# Altium schematic sheet tinyCore.SchDoc
size 444 x 241 mm; SheetNumber: 1; SheetTotal: 4
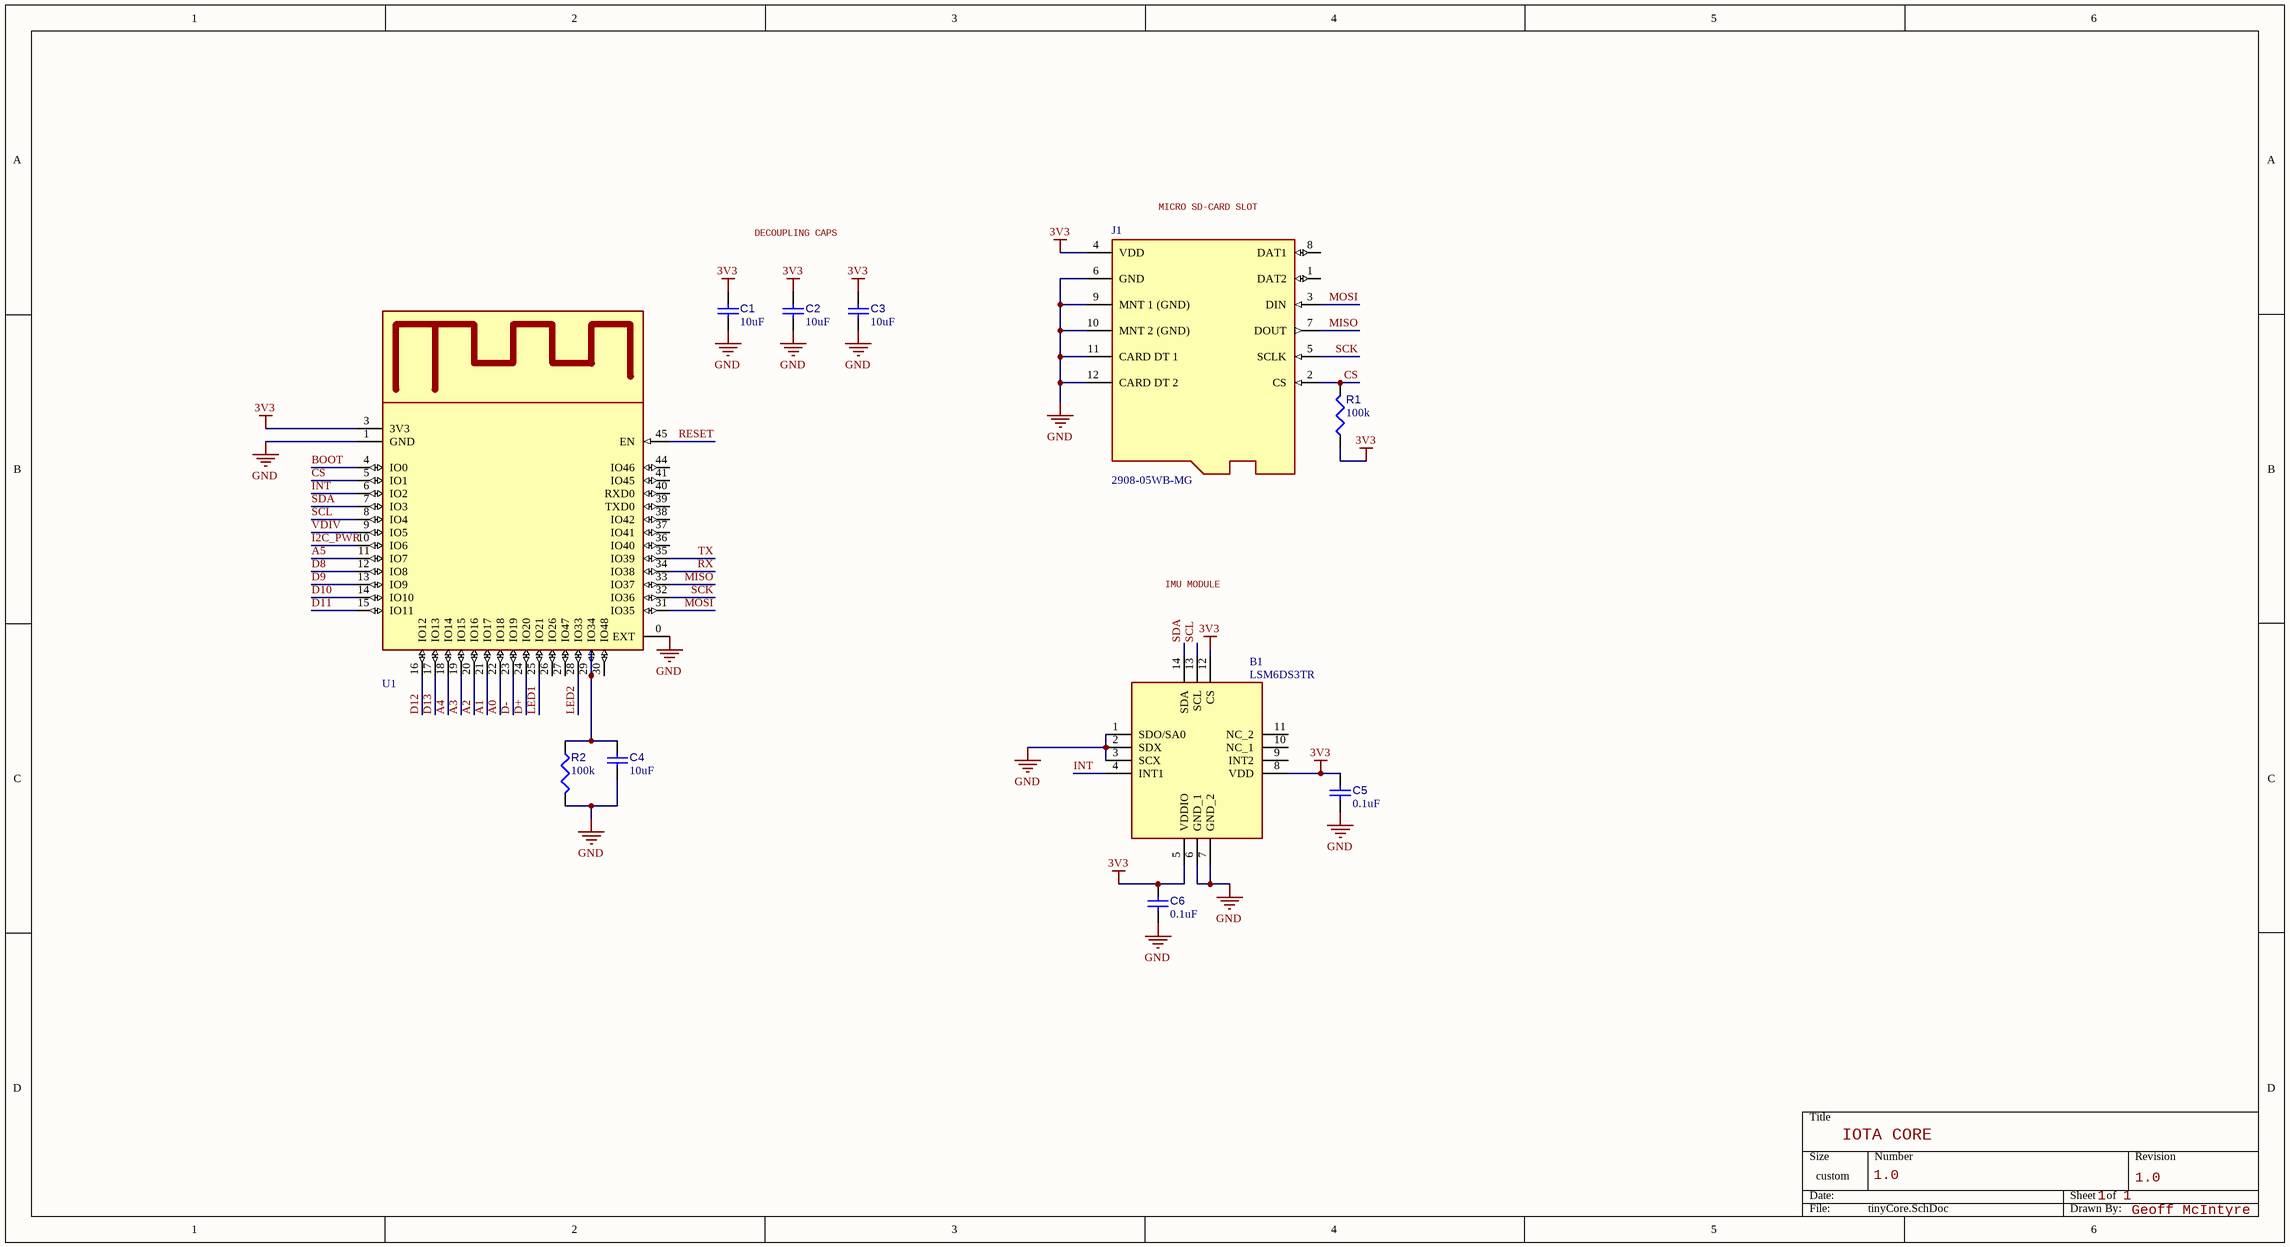
[diagram p0: tinyCore.SchDoc]

## Parts
B1  LSM6DS3TR  [LSM6DS3TR]
C1  value 10uF  [CAPC1608X87X35NL15T15]  (hidden comment: Capacitor 10 uF +/- 0.25 uF 50 V 0603)
C2  value 10uF  [CAPC1608X87X35NL15T15]  (hidden comment: Capacitor 10 uF +/- 0.25 uF 50 V 0603)
C3  value 10uF  [CAPC1608X87X35NL15T15]  (hidden comment: Capacitor 10 uF +/- 0.25 uF 50 V 0603)
C4  value 10uF  [CAPC1608X87X35NL15T15]  (hidden comment: Capacitor 10 uF +/- 0.25 uF 50 V 0603)
C5  value 0.1uF  [CAPC1608X87X35NL15T15]  (hidden comment: Capacitor  0.1 uF 50 V 0603)
C6  value 0.1uF  [CAPC1608X87X35NL15T15]  (hidden comment: Capacitor  0.1 uF 50 V 0603)
J1  2908-05WB-MG  [FP-2908-05WB-MG-MFG]
R1  value 100k  [RESC1608X55X25ML10T15]  (hidden comment: Resistor 100k +/-1% 0603 100 mW)
R2  value 100k  [RESC1608X55X25ML10T15]  (hidden comment: Resistor 100k +/-1% 0603 100 mW)
U1  ESP32-S3-MINI-1-N8  [ESP32-S3-MINI-1-N8]  (value not drawn)

## Nets
3V3: B1.5(VDDIO) B1.8(VDD) B1.12(CS) C1.2 C2.2 C3.2 C5.2 C6.2 J1.4(VDD) R1.1 U1.3(3V3)
GND: B1.1(SDO/SA0) B1.2(SDX) B1.3(SCX) B1.6(GND_1) B1.7(GND_2) C1.1 C2.1 C3.1 C4.1 C5.1 C6.1 J1.6(GND) J1.9(MNT_1_(GND)) J1.10(MNT_2_(GND)) J1.11(CARD_DT_1) J1.12(CARD_DT_2) R2.2 U1.0(EXT) U1.1(GND)
A0: U1.22(IO18)
A1: U1.21(IO17)
A2: U1.20(IO16)
A3: U1.19(IO15)
A4: U1.18(IO14)
A5: U1.11(IO7)
BOOT: U1.4(IO0)
CS: J1.2(CS) R1.2 U1.5(IO1)
D8: U1.12(IO8)
D9: U1.13(IO9)
D10: U1.14(IO10)
D11: U1.15(IO11)
D12: U1.16(IO12)
D13: U1.17(IO13)
D+: U1.24(IO20)
D-: U1.23(IO19)
I2C_PWR: U1.10(IO6)
INT: B1.4(INT1) U1.6(IO2)
LED1: U1.25(IO21)
LED2: U1.28(IO33)
MISO: J1.7(DOUT) U1.33(IO37)
MOSI: J1.3(DIN) U1.31(IO35)
RESET: U1.45(EN)
RX: U1.34(IO38)
SCK: J1.5(SCLK) U1.32(IO36)
SCL: B1.13(SCL) U1.8(IO4)
SDA: B1.14(SDA) U1.7(IO3)
TX: U1.35(IO39)
VDIV: U1.9(IO5)
NetC4_2: C4.2 R2.1 U1.29(IO34)

Not connected (* = marked no-connect by the designer): B1 9(INT2) 10(NC_1) 11(NC_2); J1 1(DAT2) 8(DAT1); U1 26(IO26) 27(IO47) 30(IO48) 36(IO40) 37(IO41) 38(IO42) 39(TXD0) 40(RXD0) 41(IO45) 44(IO46)

## Notes on the sheet
- (near J1) MICRO SD-CARD SLOT
- DECOUPLING CAPS
- IMU MODULE
- IOTA CORE
- 1.0
- 1  1
- Geoff McIntyre

## Library data of the parts
B1 = CMP-084-000000-2: DFD PROTECTION & FILTER; Manufacturer_Name: STMicroelectronics; Geometry.Height: 0.86mm; Mouser Part Number: 511-LSM6DS3TR; Design Item ID: LSM6DS3TR; Arrow Part Number: LSM6DS3TR; Manufacturer_Part_Number: LSM6DS3TR; Datasheet Link: https://www.mouser.com/datasheet/2/389/dm00133076-1798402.pdf; Source: LSM6DS3TR.SchLib; Mouser Price/Stock: https://www.mouser.co.uk/ProductDetail/STMicroelectronics/LSM6DS3TR?qs=Ok1pvOkw6%2FrQmhGoCLrQkA%3D%3D; Arrow Price/Stock: https://www.arrow.com/en/products/lsm6ds3tr/stmicroelectronics?region=nac
C1-C4 = CMP-001-00012-6: Chip Capacitor, 10 uF, +/- 0.25 uF, 50 V, 0603 (1608 Metric); Tolerance: 0.25%; Capacitor Type: Ceramic; Voltage Rating: 50V; Max Operating Temperature: 125°C; RoHS Compliant: True; Mounting Technology: SM; Pins: 2; Case/Package: 0603; Min Operating Temperature: -55°C
C5 C6 = CMP-001-00012-6: Chip Capacitor, 0.1 uF, +/- 0.25 pF, 50 V, 0603 (1608 Metric); Tolerance: 0.25%; Capacitor Type: Ceramic; Voltage Rating: 50V; Max Operating Temperature: 125°C; RoHS Compliant: True; Mounting Technology: SM; Pins: 2; Case/Package: 0603; Min Operating Temperature: -55°C
J1 = CMP-019-00049-1: CONN MICRO SD CARD PUSH-PUSH R/A
R1 R2 = CMP-009-00023-5: Chip Resistor, 100 KOhm, +/- 1%, 0.1 W, -55 to 155 degC, 0603 (1608 Metric); Voltage Rating: 50V; Power: 100mW; Max Operating Temperature: 155°C; RoHS Compliant: True; Tolerance: 1%; Pins: 2; Case/Package: 0603; Mounting Technology: SM; Min Operating Temperature: -55°C
U1 = CMP-010-000006-5: SMD module, ESP32-S3FN8, 8 MB SPI flash, PCB antenna; Manufacturer: Espressif Systems; Nominal Vf: 3V ~ 3.6V; Min Operating Temperature: -40°C; Source: ESP32-S3-MINI-1-N8.SchLib; DigiKey Part Number: 1965-ESP32-S3-MINI-1-N8CT-ND; Mounting Technology: Surface Mount; Manufacturer Part Number: ESP32-S3-MINI-1-N8; Component Type: Microcontroller; RoHS Compliant: Yes; Max Operating Temperature: 85°C; Pins: 73; Case/Package: 41-SMD Module; Availability: In Stock